# Altium project Telemetry.PrjPcb
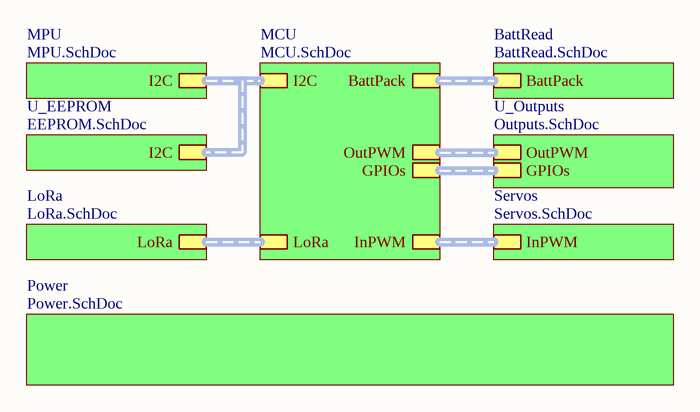
[diagram p0: main.SchDoc]
9 sheets, 65 parts. Net scope: hierarchical (ports join the sheet entries above them; power ports are global).
Board file: telemetry.PcbDoc
Sheets:
  main.SchDoc
    MCU = MCU.SchDoc
    LoRa = LoRa.SchDoc
    BattRead = BattRead.SchDoc
    Servos = Servos.SchDoc
    U_Outputs = Outputs.SchDoc
    MPU = MPU.SchDoc
    Power = Power.SchDoc
    U_EEPROM = EEPROM.SchDoc

## Sheet main.SchDoc
size 127 x 101 mm; SheetNumber: 1; SheetTotal: 9

### Sub-sheets
BattRead = BattRead.SchDoc: BattPack (harness BattPack)
LoRa = LoRa.SchDoc: LoRa (harness LoRa)
MCU = MCU.SchDoc: BattPack (harness BattPack), LoRa (harness LoRa), I2C (harness I2C), InPWM (harness InPWM), OutPWM (harness OutPWM), GPIOs (harness GPIOs)
MPU = MPU.SchDoc: I2C (harness I2C)
Power = Power.SchDoc: no entries
Servos = Servos.SchDoc: InPWM (harness InPWM)
U_EEPROM = EEPROM.SchDoc: I2C (harness I2C)
U_Outputs = Outputs.SchDoc: OutPWM (harness OutPWM), GPIOs (harness GPIOs)

### Buses and harness runs
harness sheet BattRead/BattPack = sheet MCU/BattPack
harness sheet LoRa/LoRa = sheet MCU/LoRa
harness sheet MCU/GPIOs = sheet U_Outputs/GPIOs
harness sheet MCU/I2C = sheet MPU/I2C = sheet U_EEPROM/I2C
harness sheet MCU/InPWM = sheet Servos/InPWM
harness sheet MCU/OutPWM = sheet U_Outputs/OutPWM

## Sheet MCU.SchDoc
size 177 x 241 mm; SheetNumber: 7; SheetTotal: 9
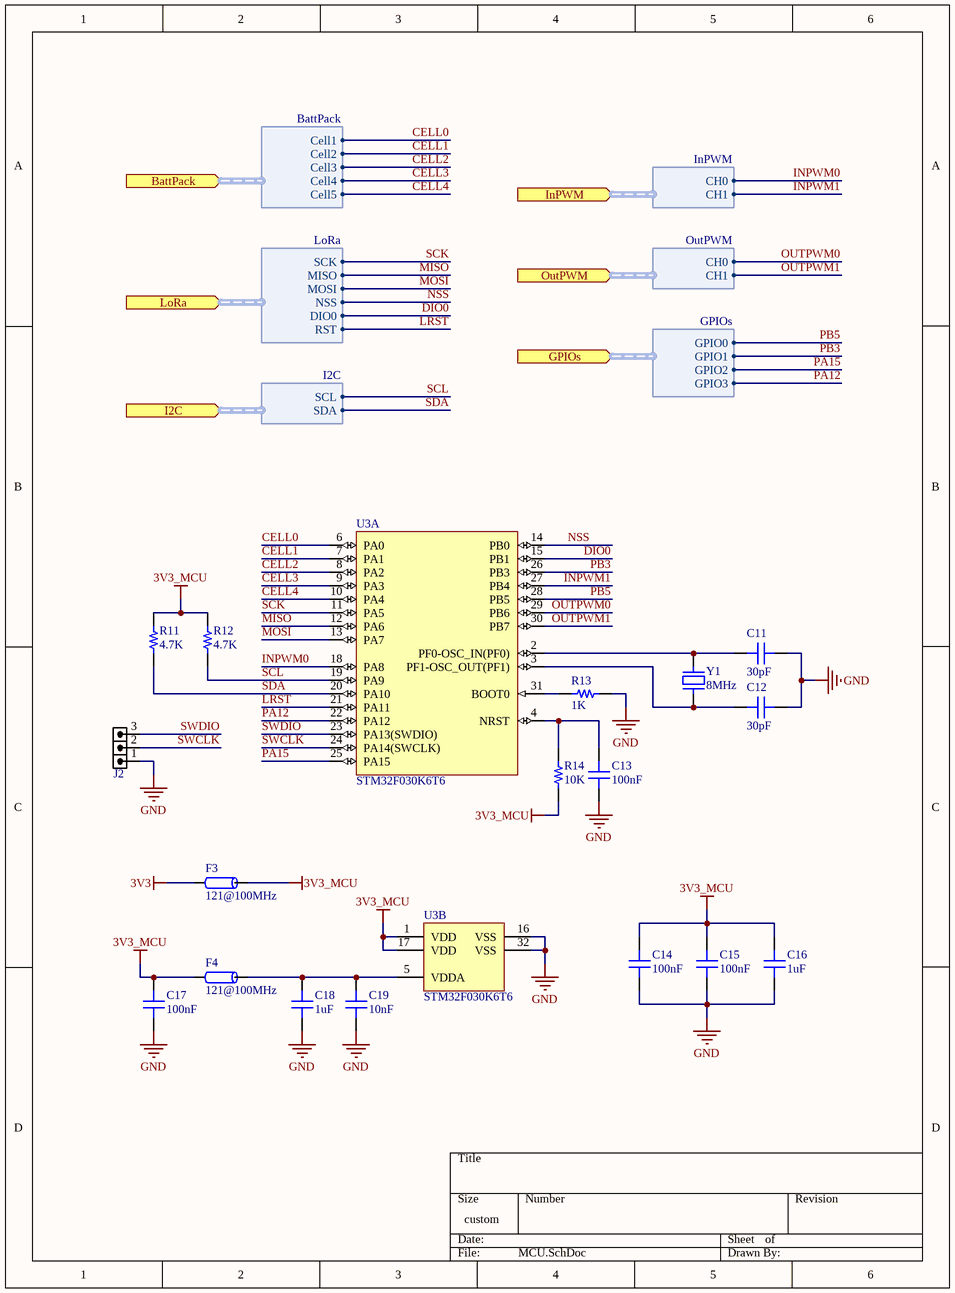
[diagram p1: MCU.SchDoc]

### Parts
C11  30pF  [CAP 0603_1608]
C12  30pF  [CAP 0603_1608]
C13  100nF  [CAP 0603_1608]
C14  100nF  [CAP 0603_1608]
C15  100nF  [CAP 0603_1608]
C16  1uF  [CAP 0603_1608]
C17  100nF  [CAP 0603_1608]
C18  1uF  [CAP 0603_1608]
C19  10nF  [CAP 0603_1608]
F3  121@100MHz  [Ferrite-0805]
F4  121@100MHz  [Ferrite-0805]
J2  HDRM3  [HDR_M_1X3]  (value not drawn)
R11  4.7K  [RES 0603_1608]
R12  4.7K  [RES 0603_1608]
R13  1K  [RES 0603_1608]
R14  10K  [RES 0603_1608]
U3  STM32F030K6T6  [LQFP-32 7X7MM P0.8MM]  (parts A,B of 2)
Y1  8MHz  [HC-49S SMD]

### Ports
BattPack (in, harness BattPack), GPIOs (in, harness GPIOs), I2C (in, harness I2C), InPWM (in, harness InPWM), LoRa (in, harness LoRa), OutPWM (in, harness OutPWM)

### Harnesses
BattPack: Cell1, Cell2, Cell3, Cell4, Cell5
LoRa: SCK, MISO, MOSI, NSS, DIO0, RST
I2C: SCL, SDA
InPWM: CH0, CH1
OutPWM: CH0, CH1
GPIOs: GPIO0, GPIO1, GPIO2, GPIO3

### Nets
3V3: F3.1
3V3_MCU: C14.2 C15.2 C16.2 C17.2 F3.2 F4.1 R11.2 R12.2 R14.1 U3.1(VDD) U3.17(VDD)
GND: C11.2 C12.2 C13.1 C14.1 C15.1 C16.1 C17.1 C18.1 C19.1 J2.1 R13.2 U3.16(VSS) U3.32(VSS)
CELL0: U3.6(PA0) ; port BattPack.Cell1
CELL1: U3.7(PA1) ; port BattPack.Cell2
CELL2: U3.8(PA2) ; port BattPack.Cell3
CELL3: U3.9(PA3) ; port BattPack.Cell4
CELL4: U3.10(PA4) ; port BattPack.Cell5
DIO0: U3.15(PB1) ; port LoRa.DIO0
INPWM0: U3.18(PA8) ; port InPWM.CH0
INPWM1: U3.27(PB4) ; port InPWM.CH1
LRST: U3.21(PA11) ; port LoRa.RST
MISO: U3.12(PA6) ; port LoRa.MISO
MOSI: U3.13(PA7) ; port LoRa.MOSI
NSS: U3.14(PB0) ; port LoRa.NSS
OUTPWM0: U3.29(PB6) ; port OutPWM.CH0
OUTPWM1: U3.30(PB7) ; port OutPWM.CH1
PA12: U3.22(PA12) ; port GPIOs.GPIO3
PA15: U3.25(PA15) ; port GPIOs.GPIO2
PB3: U3.26(PB3) ; port GPIOs.GPIO1
PB5: U3.28(PB5) ; port GPIOs.GPIO0
SCK: U3.11(PA5) ; port LoRa.SCK
SCL: R12.1 U3.19(PA9) ; port I2C.SCL
SDA: R11.1 U3.20(PA10) ; port I2C.SDA
SWCLK: J2.2 U3.24(PA14(SWCLK))
SWDIO: J2.3 U3.23(PA13(SWDIO))
NetC11_1: C11.1 U3.2(PF0-OSC_IN(PF0)) Y1.2
NetC12_1: C12.1 U3.3(PF1-OSC_OUT(PF1)) Y1.1
NetC13_2: C13.2 R14.2 U3.4(NRST)
NetC18_2: C18.2 C19.2 F4.2 U3.5(VDDA)
NetR13_1: R13.1 U3.31(BOOT0)

### Library data of the parts
C11-C19 = Cap 0603: SMT Capacitor
  C11 C12: VALUE: 30pF
  C13-C15 C17: VALUE: 100nF
  C16 C18: VALUE: 1uF
  C19: VALUE: 10nF
F3 F4 = Ferrite Bead
J2 = HDR_M_1X3: CONN, HEADER, Male, pitch: 2.54mm, 3POS; VALUE: HDRM3
R11-R14 = Res 0603: SMT Resistor
  R11 R12: VALUE: 4.7K
  R13: VALUE: 1K
  R14: VALUE: 10K
U3 = STM32F030K6T6: ARM Cortex-M0 32-bit MCU, 32 KB Flash, 4 KB Internal RAM, 26 I/Os, 32-pin LQFP, -40 to 85 degC, Tray; FLASH Size (Prog) (kB): 32; I/Os (High Current): 26; Internal RAM Size (kB): 4; Operating Frequency(F) (Processor speed) (MHz): 48; Supply Voltage(Vcc) min (V): 2.4; DatasheetVersion: Rev. 1; PackageVersion: Rev. 1, 07/2013; PackageReference: LQFP32; PackageDescription: 32-Pin Low Profile Quad Flat Package, 7 x 7 mm Body, 0.8 mm Pitch; Supplier 1: Digi-Key; Supplier Part Number 1: 497-14046-ND; Supplier 2: Newark; Supplier Part Number 2: 19X6194; Supplier 3: Mouser; Supplier Part Number 3: 511-STM32F030K6T6; Core: ARM Cortex-M0; Packing: Tray; Mounting Technology: Surface Mount; PartNumber: STM32F030K6T6; ComponentLink1Description: Manufacturer URL; ComponentLink1URL: http://www.st.com/web/en/home.html; ComponentLink2Description: Datasheet; ComponentLink2URL: http://www.st.com/st-web-ui/static/active/en/resource/technical/document/datasheet/DM00088500.pdf; ComponentLink3Description: Package Specification; ComponentLink3URL: http://www.st.com/st-web-ui/static/active/en/resource/technical/document/datasheet/DM00088500.pdf
Y1 = Crystal HC-49S SMD 8MHz: SMT Crystal; PartNumber: ABLS-8.000MHZ-K4T

## Sheet LoRa.SchDoc
size 152 x 88 mm; SheetNumber: 2; SheetTotal: 8
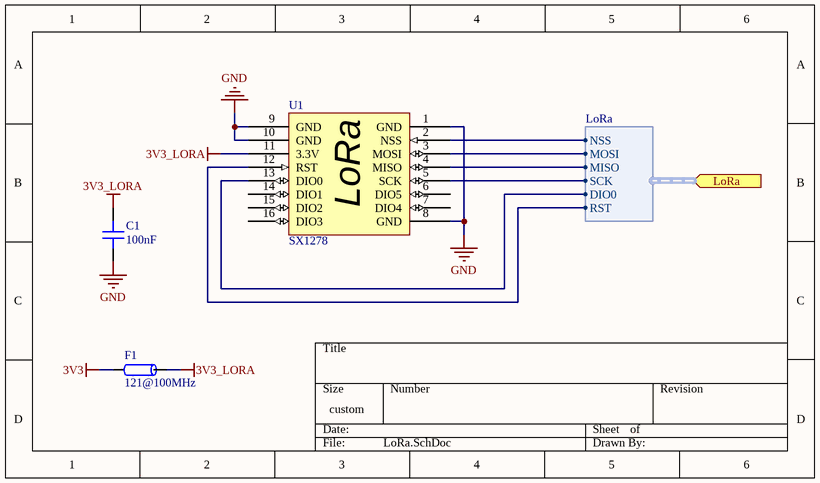
[diagram p2: LoRa.SchDoc]

### Parts
C1  100nF  [CAP 0603_1608]
F1  121@100MHz  [Ferrite-0805]
U1  SX1278  [LoRa-Ra-02]

### Ports
LoRa (in, harness LoRa)

### Harnesses
LoRa: SCK, MISO, MOSI, NSS, DIO0, RST

### Nets
3V3: F1.1
3V3_LORA: C1.2 F1.2 U1.11(3.3V)
GND: C1.1 U1.1(GND) U1.8(GND) U1.9(GND) U1.10(GND)
DIO0: U1.13(DIO0) ; port LoRa.DIO0
LRST: U1.12(RST) ; port LoRa.RST
MISO: U1.4(MISO) ; port LoRa.MISO
MOSI: U1.3(MOSI) ; port LoRa.MOSI
NSS: U1.2(NSS) ; port LoRa.NSS
SCK: U1.5(SCK) ; port LoRa.SCK

Not connected (* = marked no-connect by the designer): U1 6(DIO5) 7(DIO4) 14(DIO1) 15(DIO2) 16(DIO3)

### Notes on the sheet
- (in symbol LoRa Ra-02) LoRa

### Library data of the parts
C1 = Cap 0603: SMT Capacitor; VALUE: 100nF
F1 = Ferrite Bead
U1 = LoRa Ra-02

## Sheet BattRead.SchDoc
size 157 x 101 mm; SheetNumber: 4; SheetTotal: 9
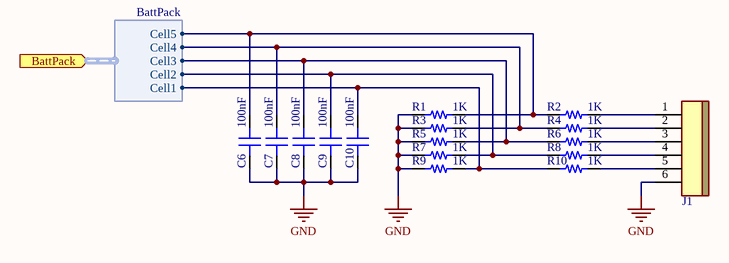
[diagram p3: BattRead.SchDoc]

### Parts
C6  100nF  [CAP 0603_1608]
C7  100nF  [CAP 0603_1608]
C8  100nF  [CAP 0603_1608]
C9  100nF  [CAP 0603_1608]
C10  100nF  [CAP 0603_1608]
J1  JST BxB-PH-K 6Pin  [JST B6B-PH-K]  (value not drawn)
R1  1K  [RES 0603_1608]
R2  1K  [RES 0603_1608]
R3  1K  [RES 0603_1608]
R4  1K  [RES 0603_1608]
R5  1K  [RES 0603_1608]
R6  1K  [RES 0603_1608]
R7  1K  [RES 0603_1608]
R8  1K  [RES 0603_1608]
R9  1K  [RES 0603_1608]
R10  1K  [RES 0603_1608]

### Ports
BattPack (in, harness BattPack)

### Harnesses
BattPack: Cell1, Cell2, Cell3, Cell4, Cell5

### Nets
GND: C6.1 C7.1 C8.1 C9.1 C10.1 J1.6 R1.1 R3.1 R5.1 R7.1 R9.1
CELL0: C10.2 R9.2 R10.1 ; port BattPack.Cell1
CELL1: C9.2 R7.2 R8.1 ; port BattPack.Cell2
CELL2: C8.2 R5.2 R6.1 ; port BattPack.Cell3
CELL3: C7.2 R3.2 R4.1 ; port BattPack.Cell4
CELL4: C6.2 R1.2 R2.1 ; port BattPack.Cell5
NetJ1_1: J1.1 R2.2
NetJ1_2: J1.2 R4.2
NetJ1_3: J1.3 R6.2
NetJ1_4: J1.4 R8.2
NetJ1_5: J1.5 R10.2

### Library data of the parts
C6-C10 = Cap 0603: SMT Capacitor; VALUE: 100nF
J1 = JST BxB-PH-K 6Pin: Connector Header Through Hole 0.079" (2.00mm); PartNumber: B6B-PH-K-S(LF)(SN)
R1-R10 = Res 0603: SMT Resistor; VALUE: 1K

## Sheet Servos.SchDoc
size 101 x 127 mm; SheetNumber: 5; SheetTotal: 8
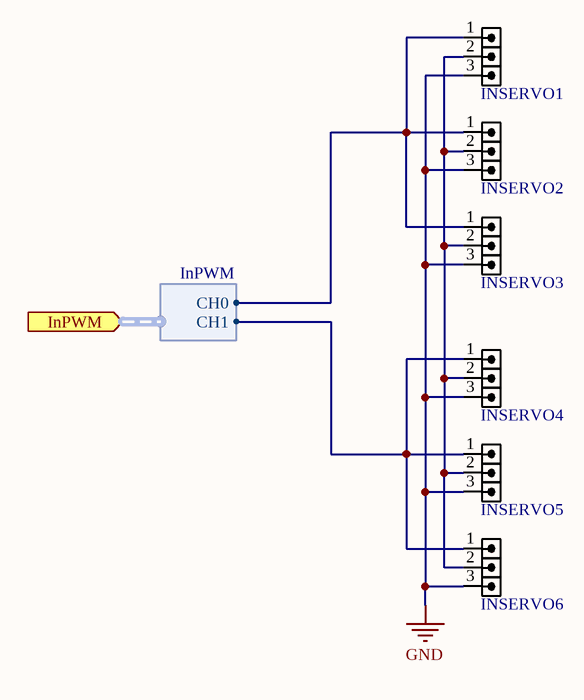
[diagram p4: Servos.SchDoc]

### Parts
INSERVO1  HDRM3  [HDR_M_1X3]  (value not drawn)
INSERVO2  HDRM3  [HDR_M_1X3]  (value not drawn)
INSERVO3  HDRM3  [HDR_M_1X3]  (value not drawn)
INSERVO4  HDRM3  [HDR_M_1X3]  (value not drawn)
INSERVO5  HDRM3  [HDR_M_1X3]  (value not drawn)
INSERVO6  HDRM3  [HDR_M_1X3]  (value not drawn)

### Ports
InPWM (in, harness InPWM)

### Harnesses
InPWM: CH0, CH1

### Nets
GND: INSERVO1.3 INSERVO2.3 INSERVO3.3 INSERVO4.3 INSERVO5.3 INSERVO6.3
INPWM0: INSERVO1.1 INSERVO2.1 INSERVO3.1 ; port InPWM.CH0
INPWM1: INSERVO4.1 INSERVO5.1 INSERVO6.1 ; port InPWM.CH1
NetINSERVO1_2: INSERVO1.2 INSERVO2.2 INSERVO3.2 INSERVO4.2 INSERVO5.2 INSERVO6.2

### Library data of the parts
INSERVO1-INSERVO6 = HDR_M_1X3: CONN, HEADER, Male, pitch: 2.54mm, 3POS; VALUE: HDRM3

## Sheet Outputs.SchDoc
size 101 x 152 mm; SheetNumber: 6; SheetTotal: 9
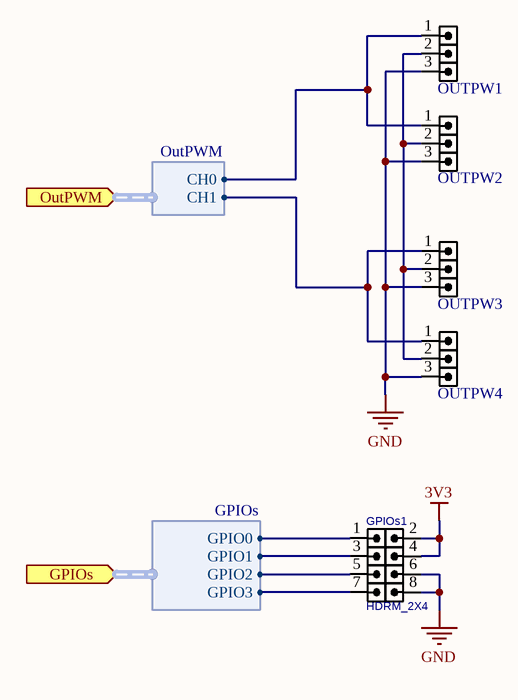
[diagram p5: Outputs.SchDoc]

### Parts
GPIOs1  HDRM_2X4  [HDR_M_2X4]
OUTPW1  HDRM3  [HDR_M_1X3]  (value not drawn)
OUTPW2  HDRM3  [HDR_M_1X3]  (value not drawn)
OUTPW3  HDRM3  [HDR_M_1X3]  (value not drawn)
OUTPW4  HDRM3  [HDR_M_1X3]  (value not drawn)

### Ports
GPIOs (in, harness GPIOs), OutPWM (in, harness OutPWM)

### Harnesses
OutPWM: CH0, CH1
GPIOs: GPIO0, GPIO1, GPIO2, GPIO3

### Nets
3V3: GPIOs1.2 GPIOs1.4
GND: GPIOs1.6 GPIOs1.8 OUTPW1.3 OUTPW2.3 OUTPW3.3 OUTPW4.3
OUTPWM0: OUTPW1.1 OUTPW2.1 ; port OutPWM.CH0
OUTPWM1: OUTPW3.1 OUTPW4.1 ; port OutPWM.CH1
PA12: GPIOs1.7 ; port GPIOs.GPIO3
PA15: GPIOs1.5 ; port GPIOs.GPIO2
PB3: GPIOs1.3 ; port GPIOs.GPIO1
PB5: GPIOs1.1 ; port GPIOs.GPIO0
NetOUTPW1_2: OUTPW1.2 OUTPW2.2 OUTPW3.2 OUTPW4.2

### Library data of the parts
GPIOs1 = HDR_M_2X4: CONN, HEADER, Male, pitch: 2.54mm, 8POS; MANF_P#: MANF_PART#; MANF: MANF; VALUE: HDRM_2X4
OUTPW1-OUTPW4 = HDR_M_1X3: CONN, HEADER, Male, pitch: 2.54mm, 3POS; VALUE: HDRM3

## Sheet MPU.SchDoc
size 127 x 101 mm; SheetNumber: 3; SheetTotal: 8
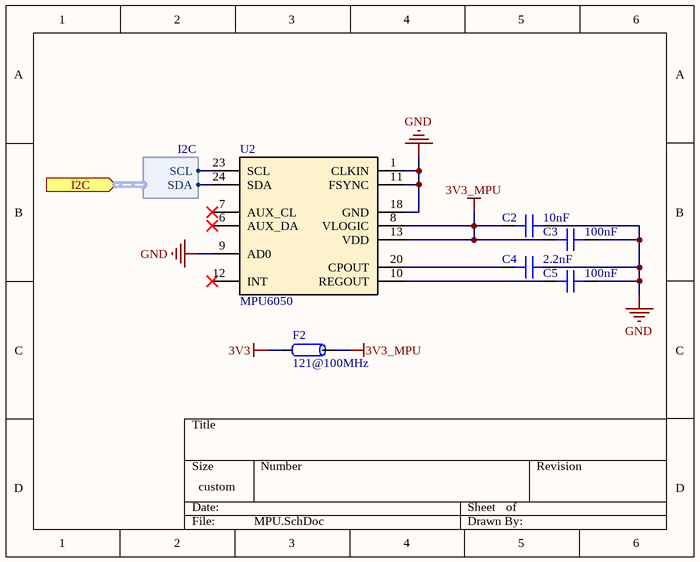
[diagram p6: MPU.SchDoc]

### Parts
C2  10nF  [CAP 0603_1608]
C3  100nF  [CAP 0603_1608]
C4  2.2nF  [CAP 0603_1608]
C5  100nF  [CAP 0603_1608]
F2  121@100MHz  [Ferrite-0805]
U2  MPU6050  [QFN-24TA]

### Ports
I2C (in, harness I2C)

### Harnesses
I2C: SCL, SDA

### Nets
3V3: F2.1
3V3_MPU: C2.2 C3.2 F2.2 U2.8(VLOGIC) U2.13(VDD)
GND: C2.1 C3.1 C4.2 C5.2 U2.1(CLKIN) U2.9(AD0) U2.11(FSYNC) U2.18(GND)
SCL: U2.23(SCL) ; port I2C.SCL
SDA: U2.24(SDA) ; port I2C.SDA
NetC4_1: C4.1 U2.20(CPOUT)
NetC5_1: C5.1 U2.10(REGOUT)

Not connected (* = marked no-connect by the designer): U2 6(AUX_DA)* 7(AUX_CL)* 12(INT)*

### Library data of the parts
C2-C5 = Cap 0603: SMT Capacitor
  C2: VALUE: 10nF
  C3 C5: VALUE: 100nF
  C4: VALUE: 2.2nF
F2 = Ferrite Bead

## Sheet Power.SchDoc
size 177 x 101 mm; SheetNumber: 8; SheetTotal: 9
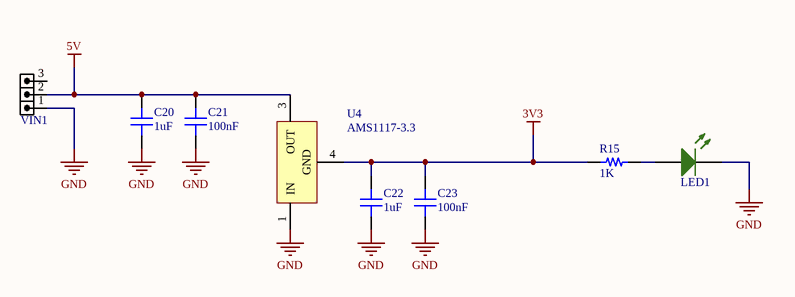
[diagram p7: Power.SchDoc]

### Parts
C20  1uF  [CAP 0805_2012]
C21  100nF  [CAP 0603_1608]
C22  1uF  [CAP 0805_2012]
C23  100nF  [CAP 0603_1608]
LED1  LED SMD 0603 GREEN  [LED_0603_GREEN]  (value not drawn)
R15  1K  [RES 0603_1608]
U4  AMS1117-3.3  [TO-252]
VIN1  HDRM3  [HDR_M_1X3]  (value not drawn)

### Nets
3V3: C22.2 C23.2 R15.1 U4.4(GND)
5V: C20.2 C21.2 U4.3(OUT) VIN1.2
GND: C20.1 C21.1 C22.1 C23.1 LED1.2(K) U4.1(IN) VIN1.1
NetLED1_1: LED1.1(A) R15.2

Not connected (* = marked no-connect by the designer): VIN1 3

### Library data of the parts
C20 C22 = Cap 0805: SMT Capacitor; VALUE: 1uF
C21 C23 = Cap 0603: SMT Capacitor; VALUE: 100nF
R15 = Res 0603: SMT Resistor; VALUE: 1K
U4 = LF33 (SMD): PartNumber: LF33CDT-TR; DatasheetVersion: Nov-2010; PackageVersion: 2011; PackageReference: TO-252; PackageDescription: 3-Pin Transistor Outline Package 2.28 mm Pitch, 9.7 mm Lead Span (DPAK); ComponentLink1Description: Manufacturer URL; ComponentLink1URL: http://www.st.com; ComponentLink2Description: Datasheet; ComponentLink2URL: http://www.st.com/internet/com/TECHNICAL_RESOURCES/TECHNICAL_LITERATURE/DATASHEET/CD00000546.pdf
VIN1 = HDR_M_1X3: CONN, HEADER, Male, pitch: 2.54mm, 3POS; VALUE: HDRM3

## Sheet EEPROM.SchDoc
size 127 x 101 mm; SheetNumber: 9; SheetTotal: 9
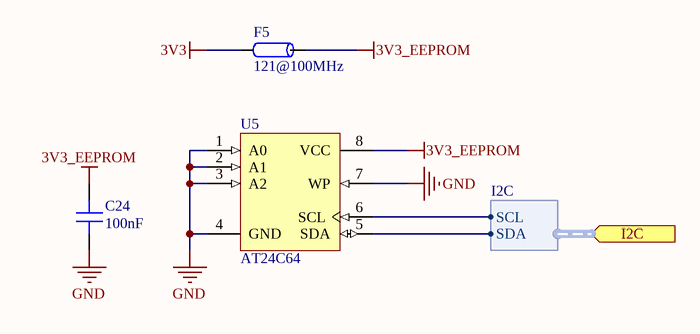
[diagram p8: EEPROM.SchDoc]

### Parts
C24  100nF  [CAP 0603_1608]
F5  121@100MHz  [Ferrite-0805]
U5  AT24C64  [TSSOP-8 3X4.4MM P0.65MM]

### Ports
I2C (in, harness I2C)

### Harnesses
I2C: SCL, SDA

### Nets
3V3: F5.1
3V3_EEPROM: C24.2 F5.2 U5.8(VCC)
GND: C24.1 U5.1(A0) U5.2(A1) U5.3(A2) U5.4(GND) U5.7(WP)
SCL: U5.6(SCL) ; port I2C.SCL
SDA: U5.5(SDA) ; port I2C.SDA

### Library data of the parts
C24 = Cap 0603: SMT Capacitor; VALUE: 100nF
F5 = Ferrite Bead
U5 = AT24C64 (SMD TSSOP): EEPROM Memory IC 64Kb (8K x 8) I²C 400kHz 900ns 8-TSSOP; PartNumber: AT24C64B-10TU-1.8

## Nets that join several sheets
3V3: MCU (F3.1), LoRa (F1.1), Outputs (GPIOs1.2 GPIOs1.4), MPU (F2.1), Power (C22.2 C23.2 R15.1 U4.4), EEPROM (F5.1)
GND: MCU (13 pins), LoRa (5 pins), BattRead (11 pins), Servos (6 pins), Outputs (6 pins), MPU (8 pins), Power (7 pins), EEPROM (6 pins)
CELL0: MCU (U3.6), BattRead (C10.2 R9.2 R10.1)
CELL1: MCU (U3.7), BattRead (C9.2 R7.2 R8.1)
CELL2: MCU (U3.8), BattRead (C8.2 R5.2 R6.1)
CELL3: MCU (U3.9), BattRead (C7.2 R3.2 R4.1)
CELL4: MCU (U3.10), BattRead (C6.2 R1.2 R2.1)
DIO0: MCU (U3.15), LoRa (U1.13)
INPWM0: MCU (U3.18), Servos (INSERVO1.1 INSERVO2.1 INSERVO3.1)
INPWM1: MCU (U3.27), Servos (INSERVO4.1 INSERVO5.1 INSERVO6.1)
LRST: MCU (U3.21), LoRa (U1.12)
MISO: MCU (U3.12), LoRa (U1.4)
MOSI: MCU (U3.13), LoRa (U1.3)
NSS: MCU (U3.14), LoRa (U1.2)
OUTPWM0: MCU (U3.29), Outputs (OUTPW1.1 OUTPW2.1)
OUTPWM1: MCU (U3.30), Outputs (OUTPW3.1 OUTPW4.1)
PA12: MCU (U3.22), Outputs (GPIOs1.7)
PA15: MCU (U3.25), Outputs (GPIOs1.5)
PB3: MCU (U3.26), Outputs (GPIOs1.3)
PB5: MCU (U3.28), Outputs (GPIOs1.1)
SCK: MCU (U3.11), LoRa (U1.5)
SCL: MCU (R12.1 U3.19), MPU (U2.23), EEPROM (U5.6)
SDA: MCU (R11.1 U3.20), MPU (U2.24), EEPROM (U5.5)